# EAGLE design gps-breakout-mk-1.0 (EAGLE 7.5.0)
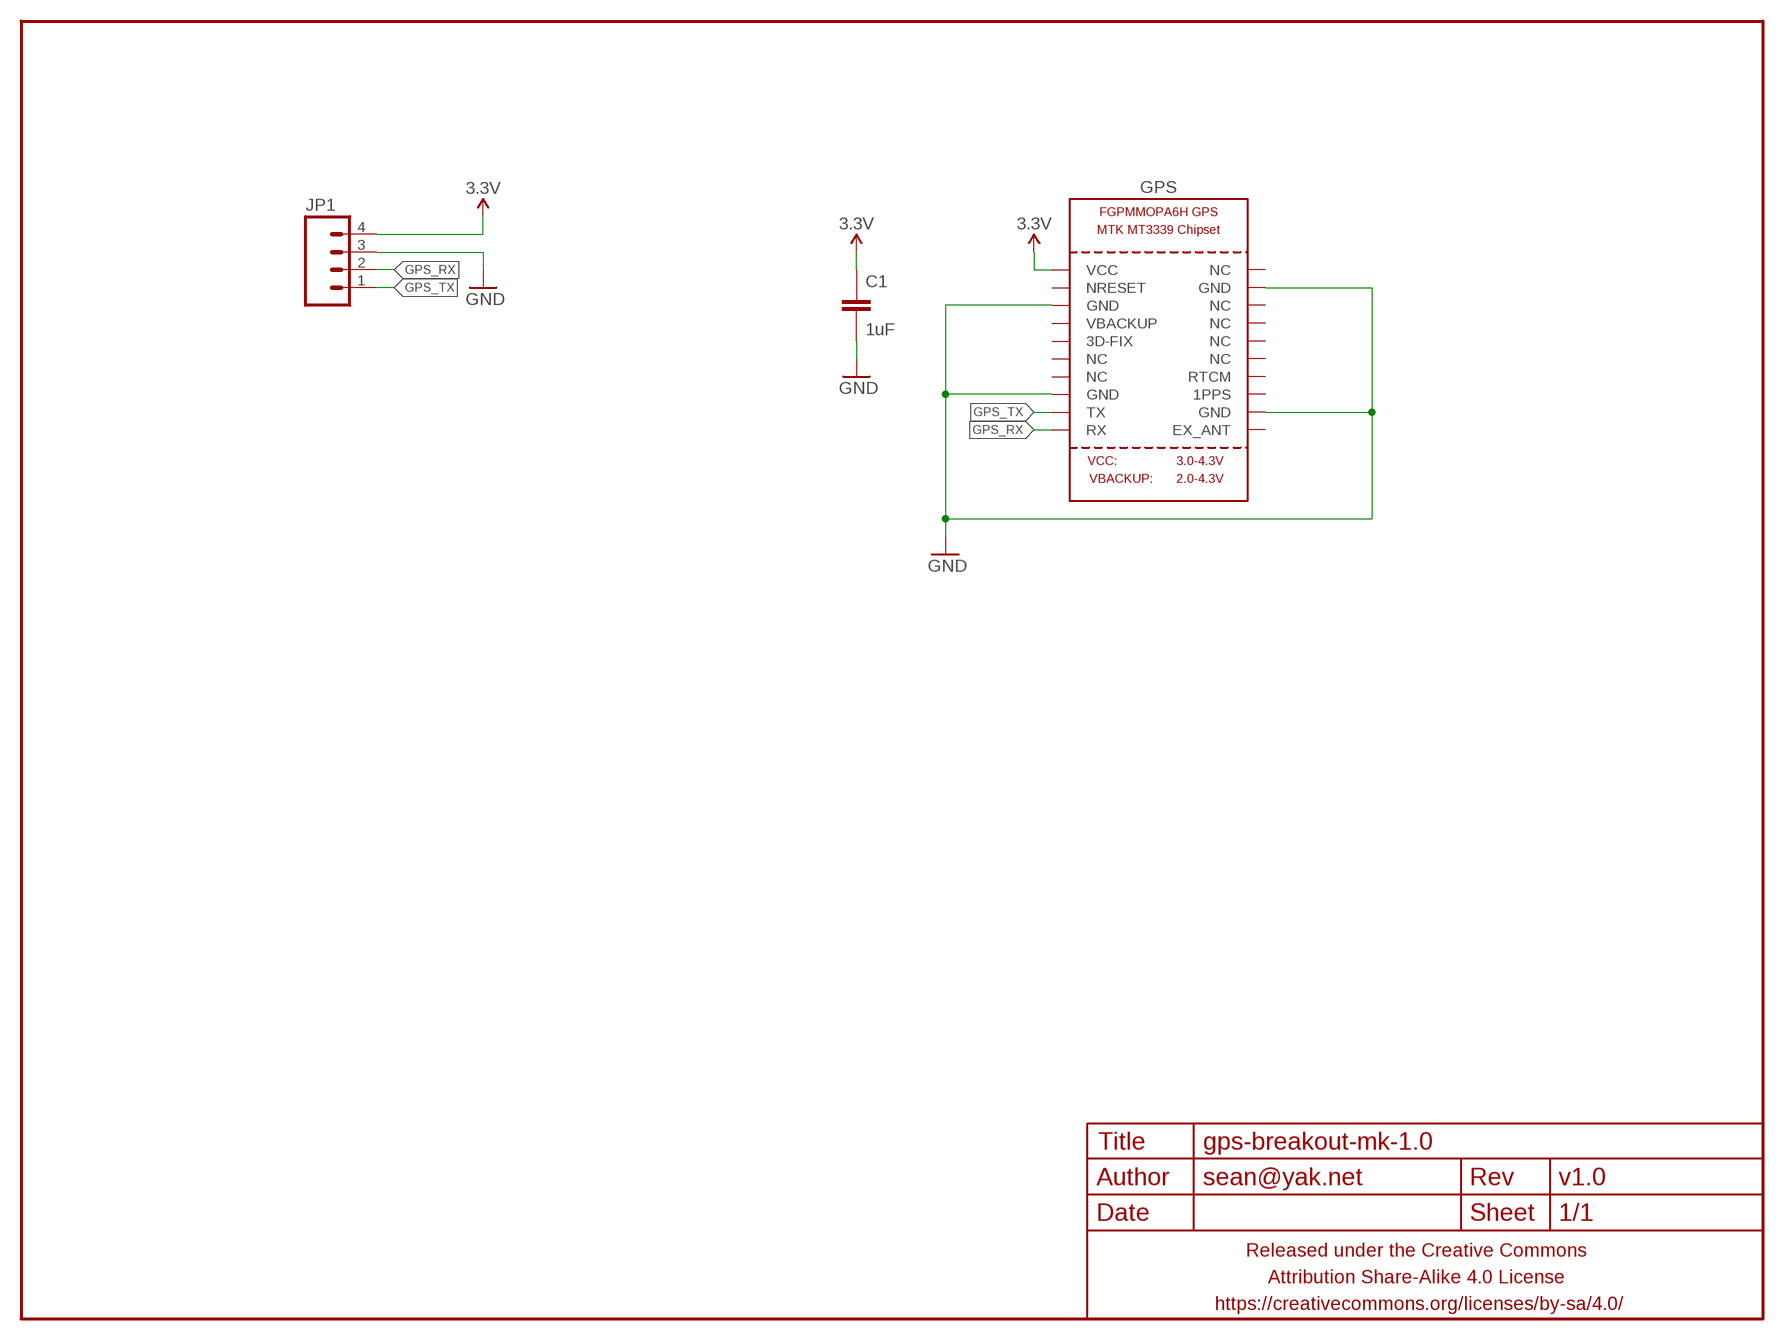
[diagram p0: schematic, sheet 1]

## Parts
C1  1uF  CAPACITOR-CERAMICC0603  [C0603]
FRAME1  FRAME-LETTERNO_PACKAGE  [DUMMY]
GPS  GPS_FGPMMOPA6H  [FGPMMOPA6H]
JP1  M04PTH-NS-CENTERED  [1X04-PTH-VERT-NS-CENTERED]

## Nets
3.3V: C1.1 GPS.P$1(VCC) JP1.4
GND: C1.2 GPS.P$3(GND) GPS.P$8(GND) GPS.P$12(GND) GPS.P$19(GND) JP1.3
GPS_RX: GPS.P$10(RX) JP1.2
GPS_TX: GPS.P$9(TX) JP1.1
Unconnected: GPS.P$2(NRESET) GPS.P$4(VBACKUP) GPS.P$5(3D-FIX) GPS.P$6(NC) GPS.P$7(NC) GPS.P$11(EX_ANT) GPS.P$13(1PPS) GPS.P$14(RTCM) GPS.P$15(NC) GPS.P$16(NC) GPS.P$17(NC) GPS.P$18(NC) GPS.P$20(NC)

## Library data of the parts
C1 = a_parts:CAPACITOR-CERAMIC: CAPACITOR, European symbol
FRAME1 = a_parts:FRAME-LETTER: Schematic Frame Standard 8.5x11 US Letter frame; DESIGNER: sean@yak.net; VERSION: v1.0
GPS = a_parts:GPS_FGPMMOPA6H: GPS Module - MTK MT3339 Chipset, -165dBm sensitivity, 22 channels, 10Hz, auto-select external antenna options
JP1 = a_parts:M04: Header 4 Standard 4-pin 0.1" header. Use with straight break away headers (SKU : PRT-00116), right angle break away headers (PRT-00553), swiss pins (PRT-00743), machine pins (PRT-00117), and female headers (PRT-00115). Molex polarized connector foot print use with SKU : PRT-08231 with associated crimp pins and housings. 1MM SMD Version SKU: PRT-10208

## Board
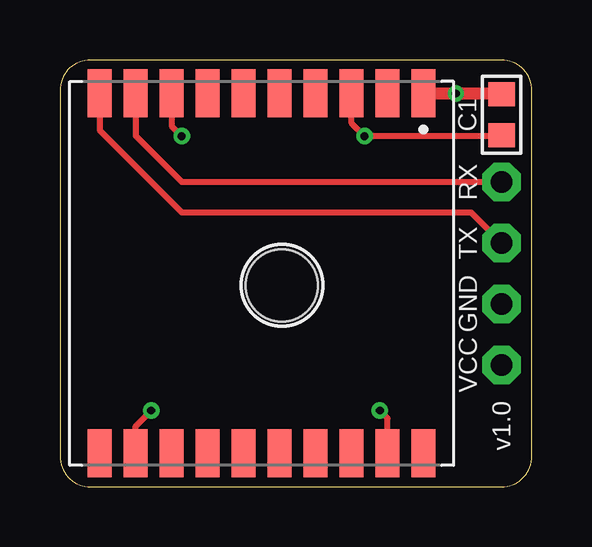
[diagram p1: board, top side]
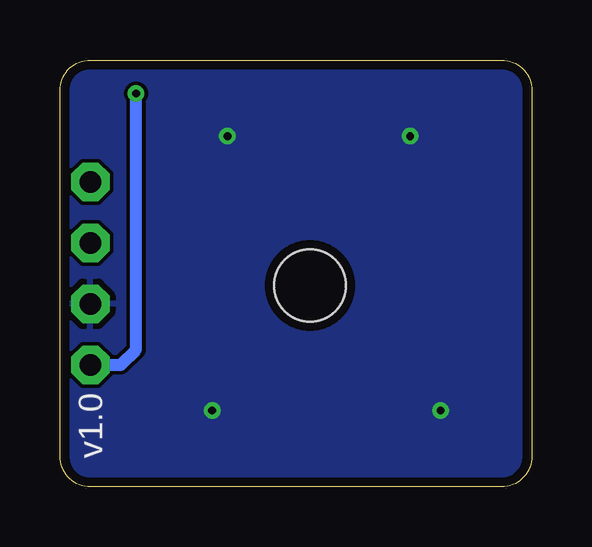
[diagram p2: board, bottom side, seen from below]

Size 19.68 x 17.78 mm. Coordinates in mm from the lower left corner, seen from the top.
Outline: 1.27,0 18.41,0 arc90 19.68,1.27 19.68,16.51 arc90 18.41,17.78 1.27,17.78 arc90 0,16.51 0,1.27 arc90 1.27,0
Copper layers (1*16): Top 0.0356mm / dielectric 1.5011mm / Bottom 0.0356mm
Design rules "LaenPCBOrder2": minimum track width 6mil, minimum drill 13mil, track to track 6mil, track to pad 6mil, pad to pad 6mil, via to via 6mil, smd to smd 6mil, copper to edge 15mil, drill to drill 6mil, minimum pad ring 7mil, minimum via ring 7mil, stop-mask expansion 3mil, vias tented up to drill 20mil, thermal gap 10mil

### Footprints (pad centres in the part's own frame; a part is rotated, then mirrored left to right if it is on the bottom)
C0603 = smd 1 x 1.1: 1 -0.85,0; 2 0.85,0
FGPMMOPA6H = smd 2 x 1: P$1 -7.5,6.75; P$2 -7.5,5.25; P$3 -7.5,3.75; P$4 -7.5,2.25; P$5 -7.5,0.75; P$6 -7.5,-0.75; P$7 -7.5,-2.25; P$8 -7.5,-3.75; P$9 -7.5,-5.25; P$10 -7.5,-6.75; P$11 7.5,-6.75; P$12 7.5,-5.25; P$13 7.5,-3.75; P$14 7.5,-2.25; P$15 7.5,-0.75; P$16 7.5,0.75; P$17 7.5,2.25; P$18 7.5,3.75; P$19 7.5,5.25; P$20 7.5,6.75 | hole 3: 0.5,0.85
1X04-PTH-VERT-NS-CENTERED = drill 0.9 pad 1.6 octagon: 1 -3.81,0; 2 -1.27,0; 3 1.27,0; 4 3.81,0

### Placement (x,y rotation side)
C1  18.41,15.49 270 top
FRAME1  0,0 0 top
GPS  8.41,8.89 270 top
JP1  18.41,8.89 270 top

### Tracks (layer width: path | path; a pad name or v marks a point on that pad's centre or on a via)
3.3V  (via drill 0.33)
  Top 0.508: GPS.P$1 v16.5,16.39 v16.51,16.38 18.38,16.38 C1.1
  Bottom 0.508: JP1.4 17.14,5.08 16.51,5.71 v16.51,16.38
GND  (via drill 0.33)
  Top 0.254: GPS.P$8 4.66,15.03 v5.08,14.61 | C1.2 18.38,14.61 v12.7,14.61 12.16,15.15 GPS.P$3 | GPS.P$12 3.16,2.52 v3.81,3.17 | GPS.P$19 13.66,2.85 v13.34,3.17
  pour Bottom: 1.27,0 18.41,0 arc90 19.68,1.27 19.68,16.51 arc90 18.41,17.78 1.27,17.78 arc90 0,16.51 0,1.27 arc90
GPS_RX
  Top 0.254: GPS.P$10 1.66,14.85 5.08,11.43 17.14,11.43 JP1.2
GPS_TX
  Top 0.254: GPS.P$9 3.16,14.62 5.08,12.7 JP1.1

### Text on the board
tNames: RX | TX | GND | VCC